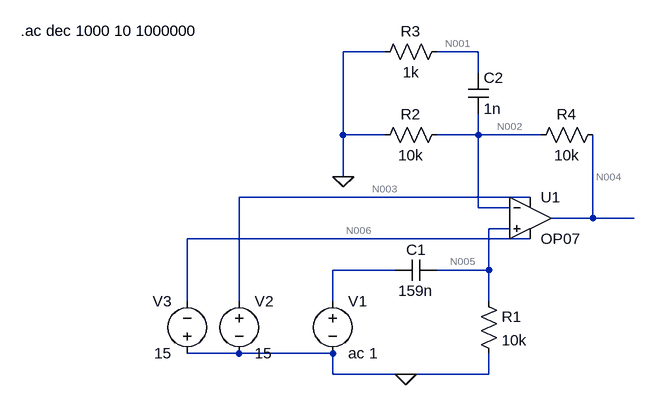
[diagram p0: schematic EQ HPF.asc]
EQ HPF.asc, the LTspice schematic file:
Version 4.1
SHEET 1 880 680
WIRE 144 -240 80 -240
WIRE 288 -240 224 -240
WIRE 288 -208 288 -240
WIRE 80 -112 80 -240
WIRE 144 -112 80 -112
WIRE 288 -112 288 -144
WIRE 288 -112 224 -112
WIRE 384 -112 288 -112
WIRE 80 -48 80 -112
WIRE 368 -16 -80 -16
WIRE 288 0 288 -112
WIRE 336 0 288 0
WIRE 464 16 464 -112
WIRE 464 16 400 16
WIRE 528 16 464 16
WIRE 336 32 304 32
WIRE 368 48 -160 48
WIRE 160 96 64 96
WIRE 304 96 304 32
WIRE 304 96 224 96
WIRE -160 144 -160 48
WIRE -80 144 -80 -16
WIRE 64 144 64 96
WIRE 304 144 304 96
WIRE -80 224 -160 224
WIRE 64 224 -80 224
WIRE 64 256 64 224
WIRE 176 256 64 256
WIRE 304 256 304 224
WIRE 304 256 176 256
FLAG 80 -48 0
FLAG 176 256 0
SYMBOL voltage 64 128 R0
WINDOW 123 0 0 Left 0
WINDOW 39 0 0 Left 0
SYMATTR InstName V1
SYMATTR Value ac 1
SYMBOL cap 224 80 R90
WINDOW 0 0 32 VBottom 2
WINDOW 3 32 32 VTop 2
SYMATTR InstName C1
SYMATTR Value 159n
SYMBOL res 288 128 R0
SYMATTR InstName R1
SYMATTR Value 10k
SYMBOL res 240 -128 R90
WINDOW 0 0 56 VBottom 2
WINDOW 3 32 56 VTop 2
SYMATTR InstName R2
SYMATTR Value 10k
SYMBOL res 240 -256 R90
WINDOW 0 0 56 VBottom 2
WINDOW 3 32 56 VTop 2
SYMATTR InstName R3
SYMATTR Value 1k
SYMBOL cap 272 -208 R0
SYMATTR InstName C2
SYMATTR Value 1n
SYMBOL res 480 -128 R90
WINDOW 0 0 56 VBottom 2
WINDOW 3 32 56 VTop 2
SYMATTR InstName R4
SYMATTR Value 10k
SYMBOL OpAmps\\OP07 368 -48 R0
SYMATTR InstName U1
SYMBOL voltage -80 128 R0
WINDOW 123 0 0 Left 0
WINDOW 39 0 0 Left 0
SYMATTR InstName V2
SYMATTR Value 15
SYMBOL voltage -160 240 R180
WINDOW 0 24 96 Left 2
WINDOW 3 24 16 Left 2
WINDOW 123 0 0 Left 0
WINDOW 39 0 0 Left 0
SYMATTR InstName V3
SYMATTR Value 15
TEXT -416 -272 Left 2 !.ac dec 1000 10 1000000

The netlist it stands for:
* EQ HPF.asc
V1 N007 0 ac 1
C1 N005 N007 159n
R1 N005 0 10k
R2 N002 0 10k
R3 N001 0 1k
C2 N001 N002 1n
R4 N004 N002 10k
X§U1 N005 N002 N003 N006 N004 LT1001  ; OP07, pins In+ In- V+ V- OUT
V2 N003 0 15
V3 0 N006 15
.ac dec 1000 10 1000000
.lib LTC.lib
.backanno
.end

* Results of the author's LTspice run, read from the files saved beside the schematic
* Operating Point, zero values left out:
*   V(n006) = -15 V
*   V(n003) = 15 V
*   I(V3) = -2.25 mA
*   I(V2) = -2.25 mA
*   Ix(u1:3) = 2.25 mA
*   Ix(u1:4) = -2.25 mA
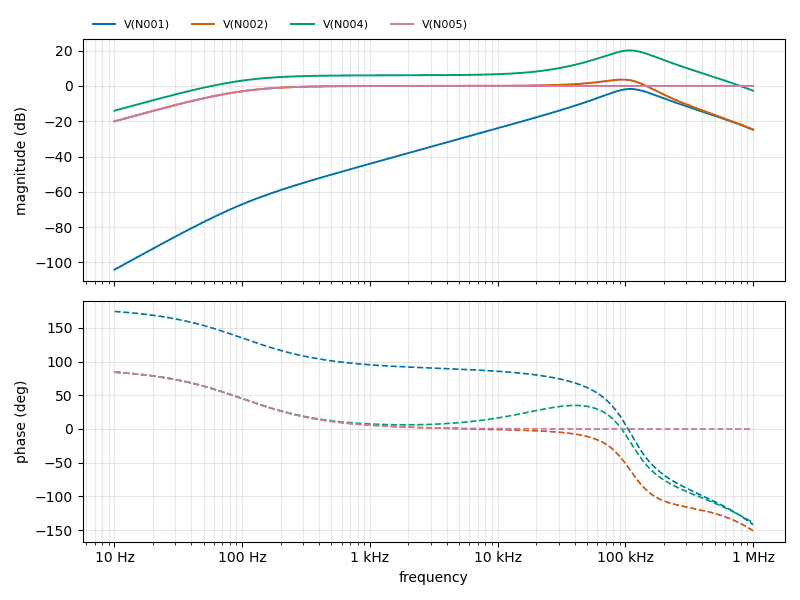
[diagram p1: AC Analysis of EQ HPF.asc, plotted from the saved traces]
* AC Analysis, 1 run:
*   V(N001): -104.09 dB at 10 Hz, -24.80 dB at 1 MHz, peak -1.72 dB at 109.4 kHz, 3 dB below the peak at 72.86 kHz and 164.1 kHz
*   V(N002): -20.05 dB at 10 Hz, -24.69 dB at 1 MHz, peak 3.61 dB at 95.06 kHz, 3 dB below the peak at 30.76 kHz and 139.7 kHz
*   V(N004): -14.03 dB at 10 Hz, -2.72 dB at 1 MHz, peak 20.12 dB at 108.4 kHz, 3 dB below the peak at 70.86 kHz and 162.3 kHz
*   V(N005): -20.05 dB at 10 Hz, -0.00 dB at 1 MHz, peak -0.00 dB at 77.45 kHz, 3 dB below the peak at 100.1 Hz